# EAGLE schematic FullBoard (EAGLE 9.3.2)
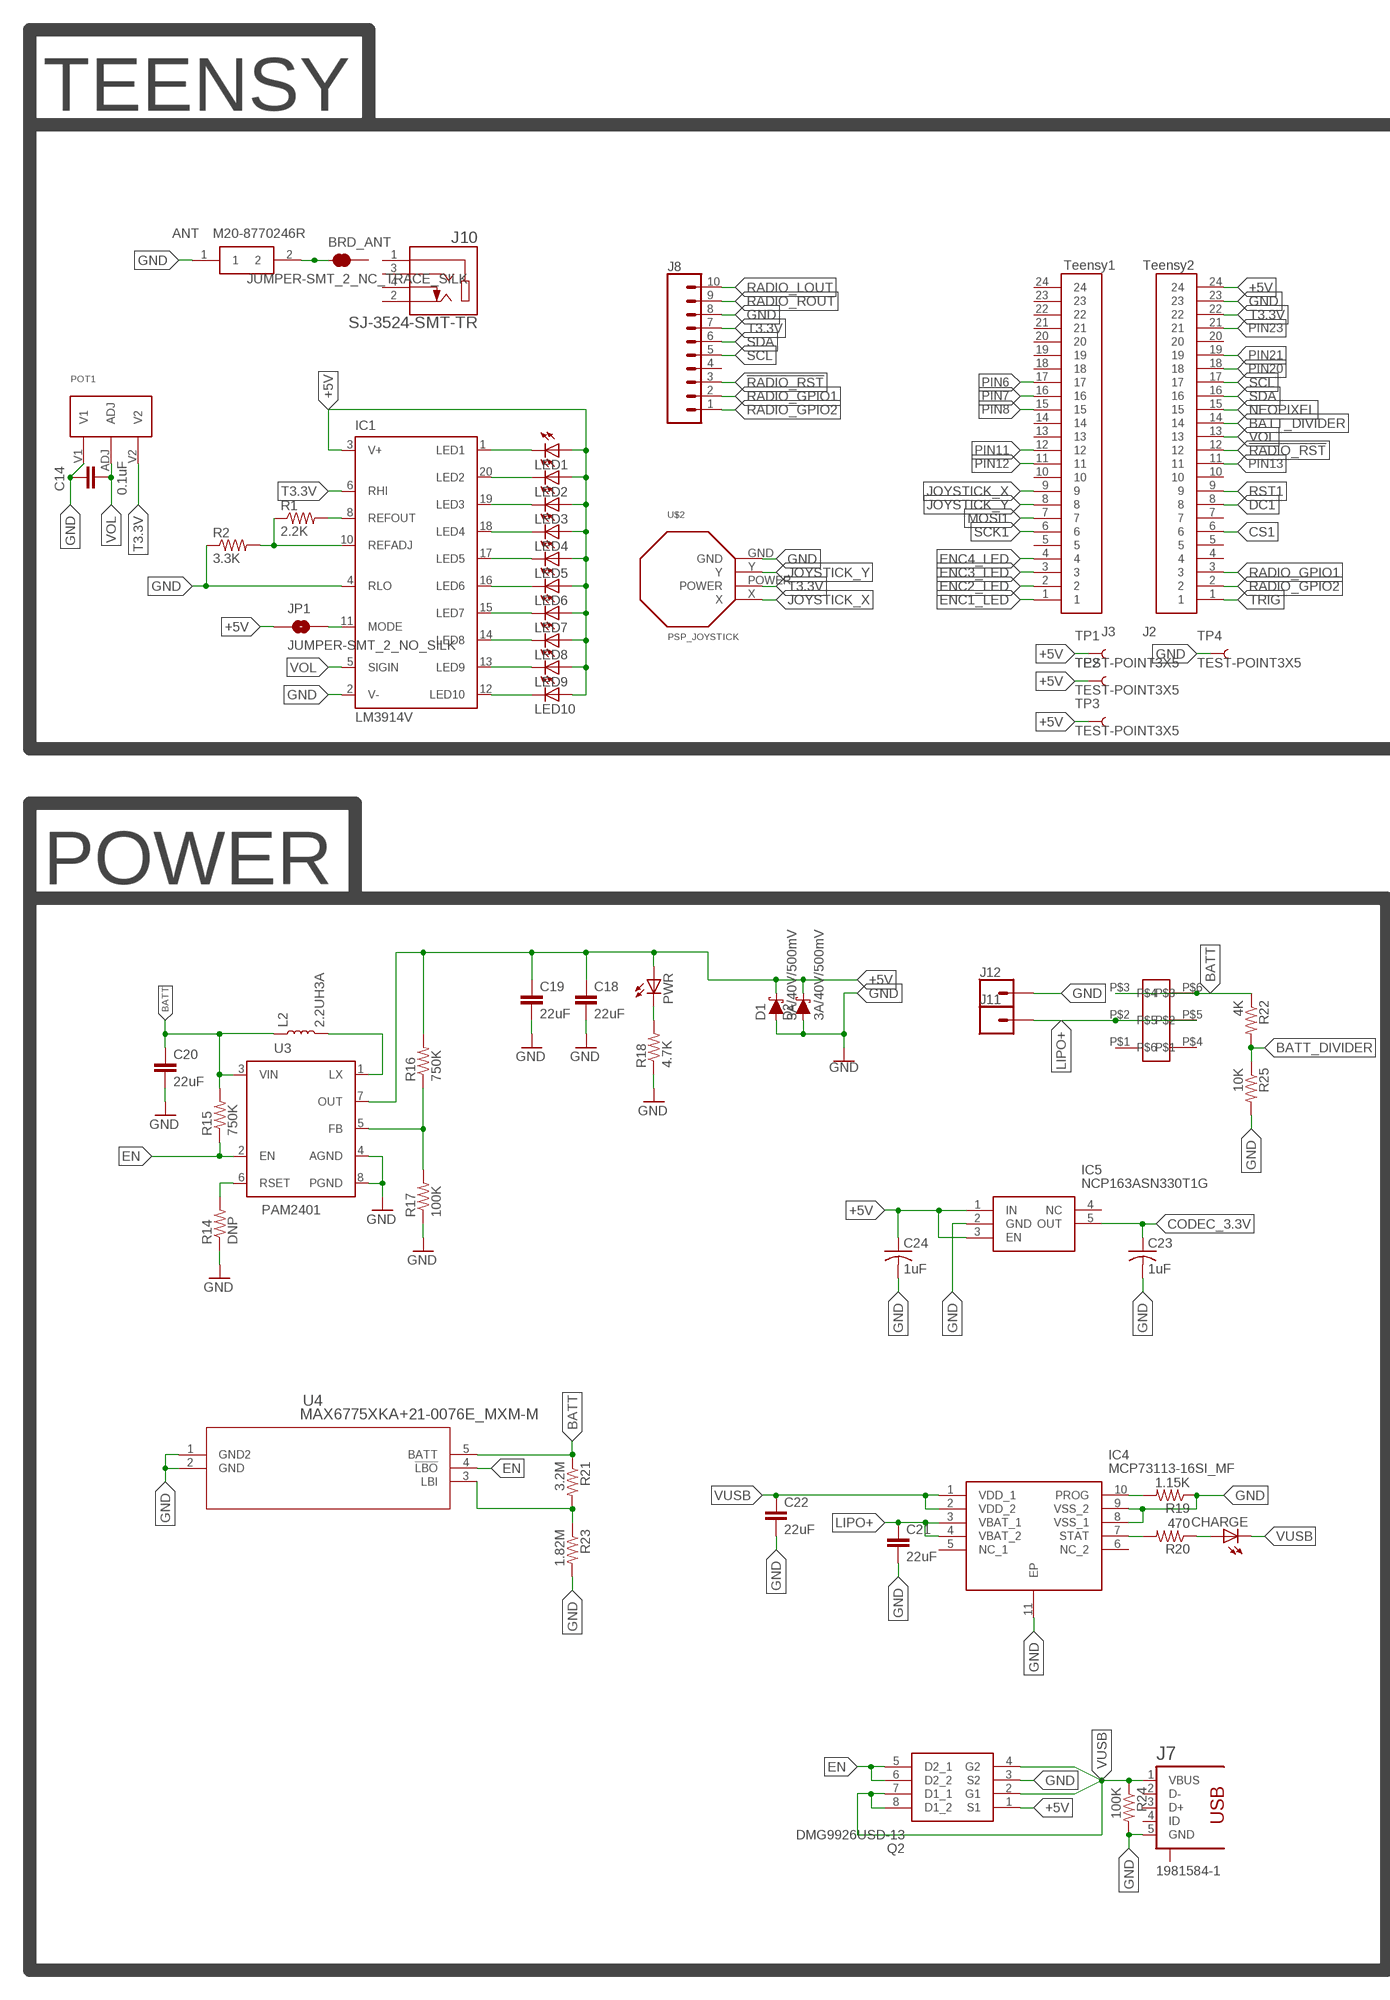
[diagram p0: schematic, sheet 1, part 1 of 3]
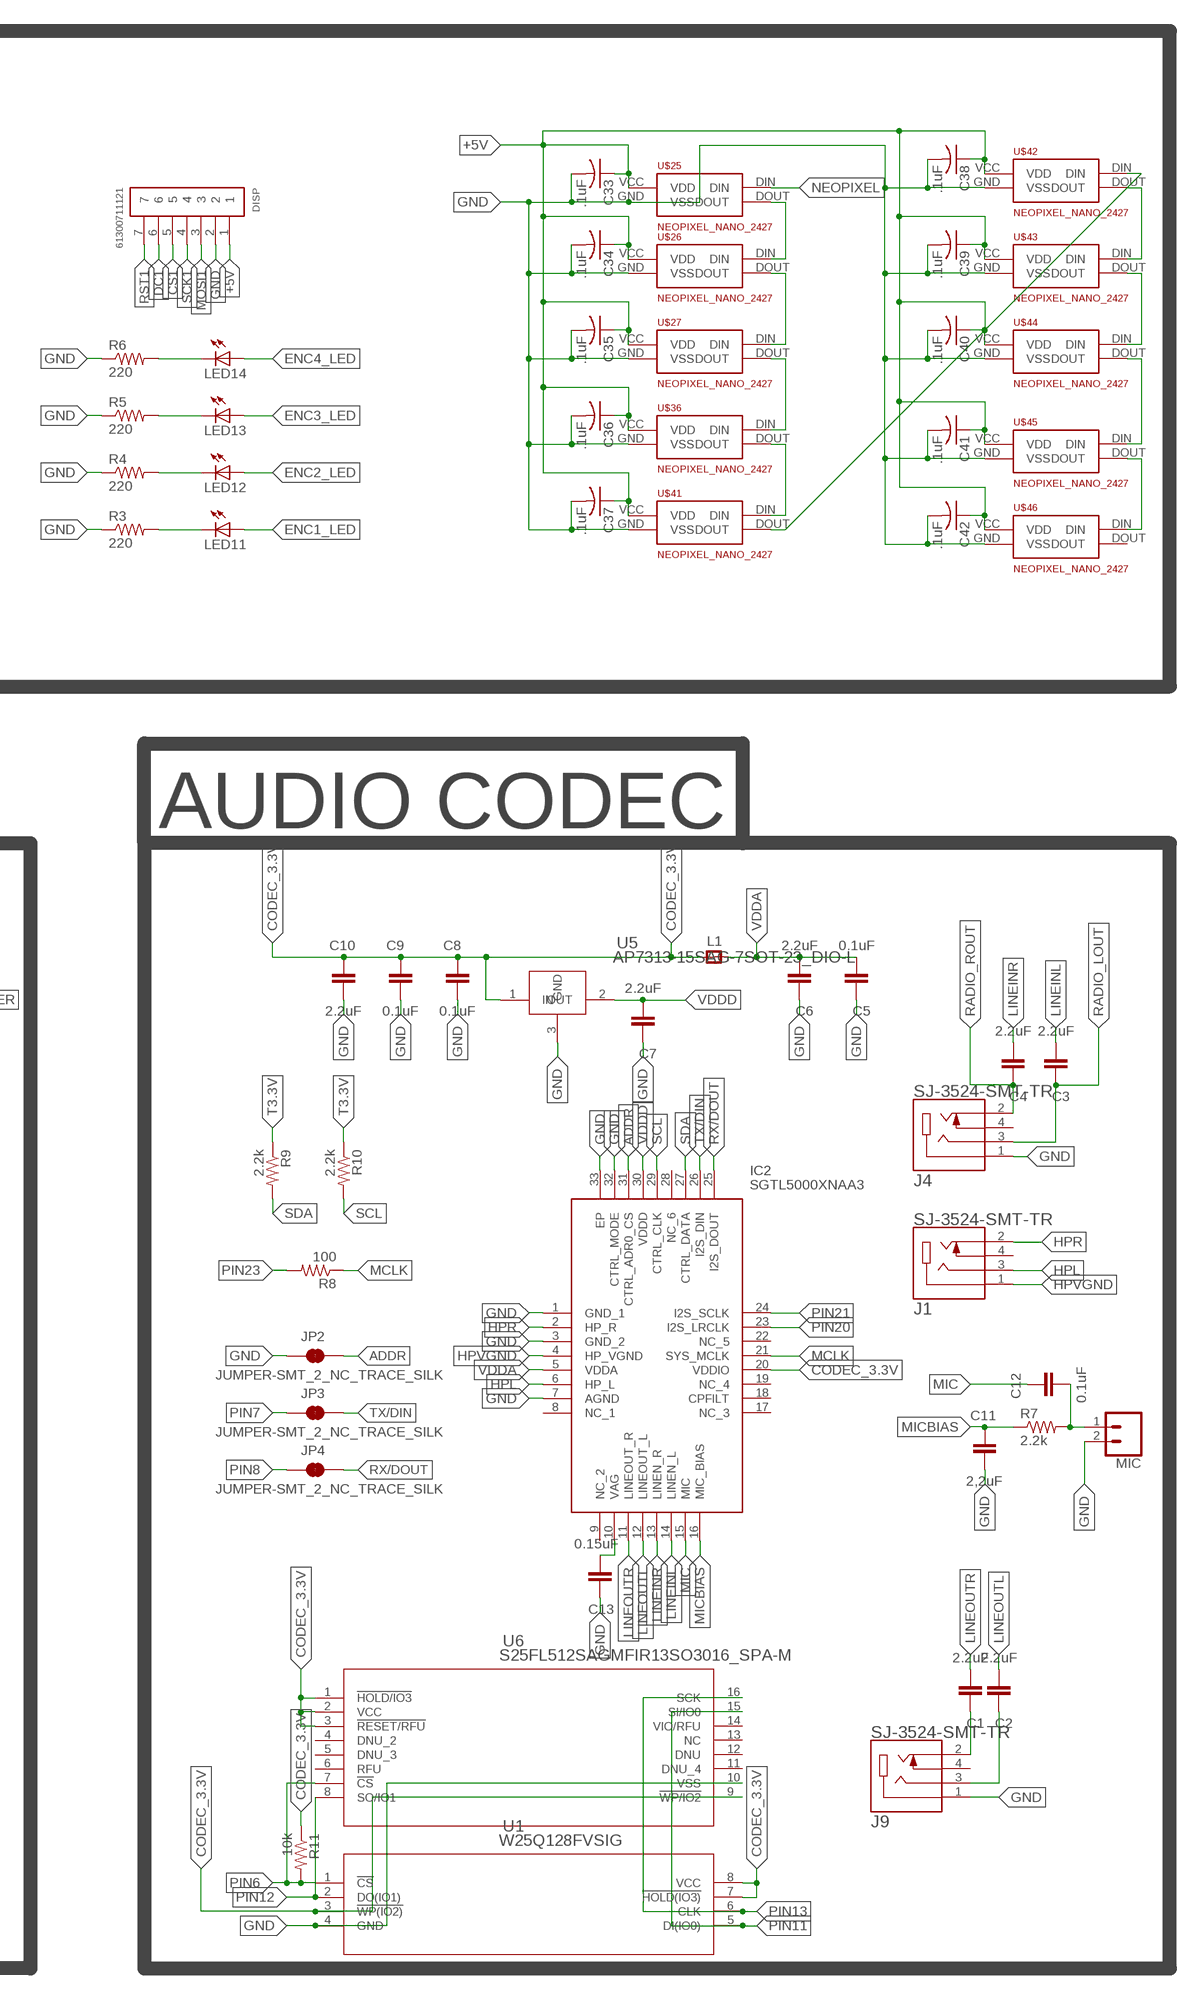
[diagram p1: schematic, sheet 1, part 2 of 3]
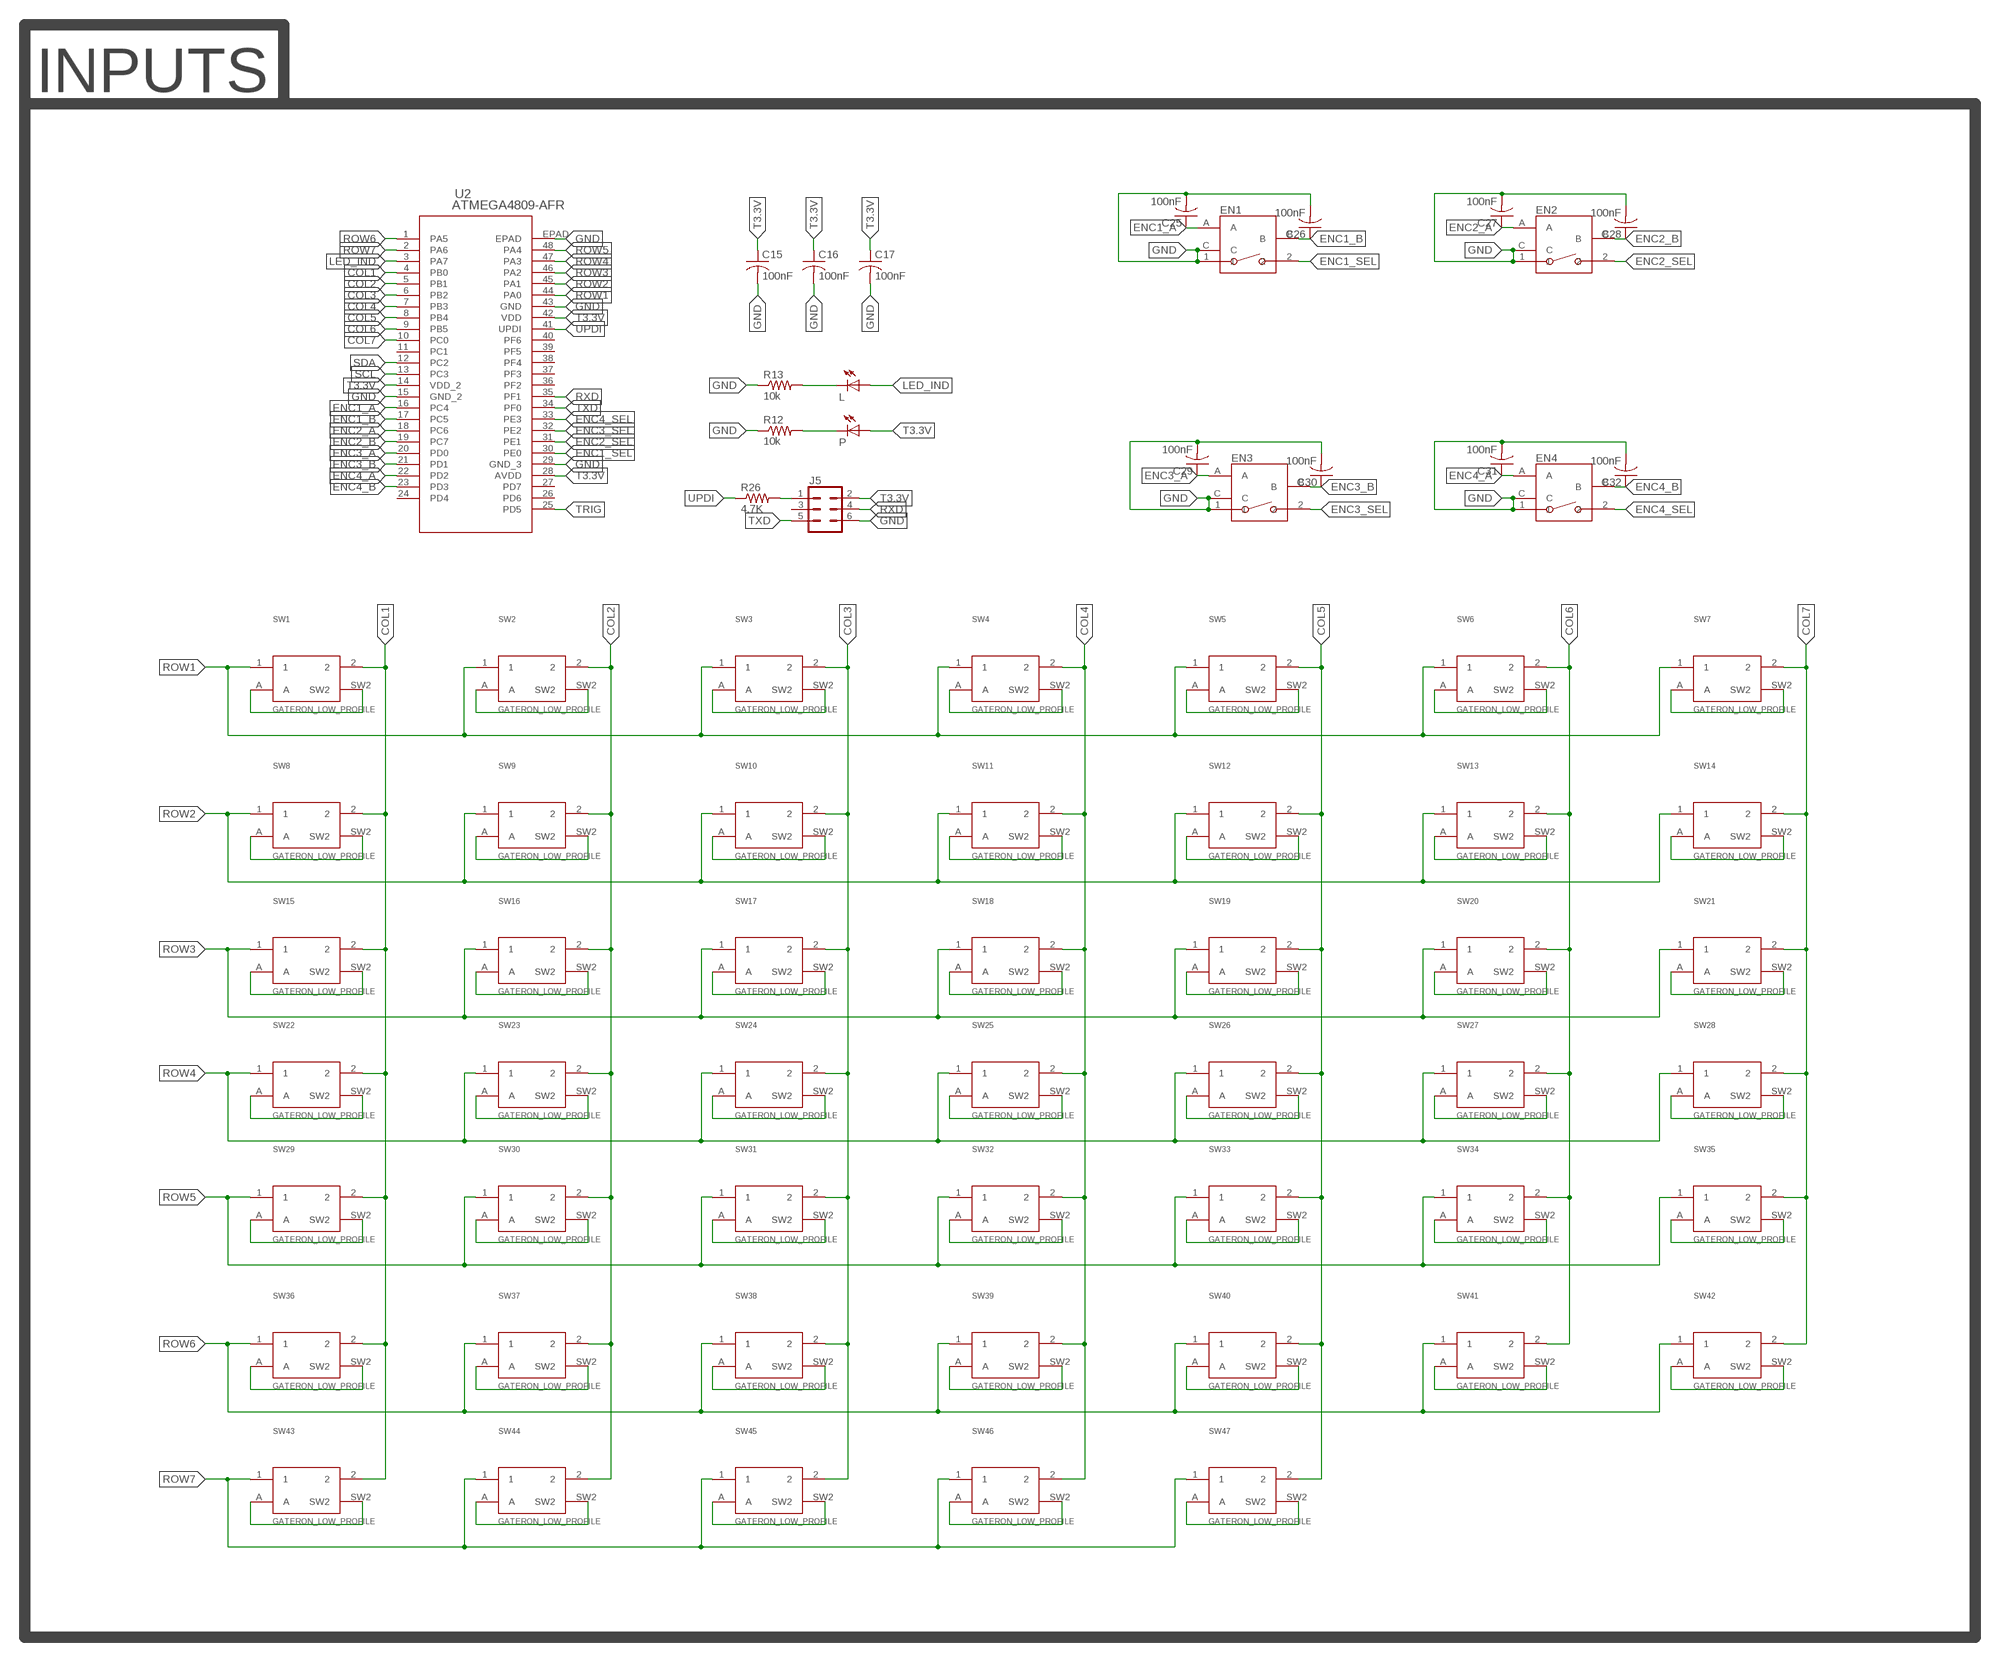
[diagram p2: schematic, sheet 1, part 3 of 3]

## Parts
ANT  M20-8770246R  [M208770246R]
BRD_ANT  JUMPER-SMT_2_NC_TRACE_SILK  [SMT-JUMPER_2_NC_TRACE_SILK]
C1  2.2uF  CC0805KRX7R9BB104  [CAP_0805]
C2  2.2uF  CC0805KRX7R9BB104  [CAP_0805]
C3  2.2uF  CC0805KRX7R9BB104  [CAP_0805]
C4  2.2uF  CC0805KRX7R9BB104  [CAP_0805]
C5  0.1uF  CC0805KRX7R9BB104  [CAP_0805]
C6  2.2uF  CC0805KRX7R9BB104  [CAP_0805]
C7  2.2uF  CC0805KRX7R9BB104  [CAP_0805]
C8  0.1uF  CC0805KRX7R9BB104  [CAP_0805]
C9  0.1uF  CC0805KRX7R9BB104  [CAP_0805]
C10  2.2uF  CC0805KRX7R9BB104  [CAP_0805]
C11  2,2uF  CC0805KRX7R9BB104  [CAP_0805]
C12  0.1uF  CC0805KRX7R9BB104  [CAP_0805]
C13  0.15uF  CC0805KRX7R9BB104  [CAP_0805]
C14  0.1uF  CC0805KRX7R9BB104  [CAP_0805]
C15  100nF  C-USC0805  [C0805]
C16  100nF  C-USC0805  [C0805]
C17  100nF  C-USC0805  [C0805]
C18  22uF  22UF-0805-6.3V-20%  [0805]
C19  22uF  22UF-0805-6.3V-20%  [0805]
C20  22uF  22UF-0805-6.3V-20%  [0805]
C21  22uF  22UF-0805-6.3V-20%  [0805]
C22  22uF  22UF-0805-6.3V-20%  [0805]
C23  1uF  C-USC1206  [C1206]
C24  1uF  C-USC1206  [C1206]
C25  100nF  C-USC0805  [C0805]
C26  100nF  C-USC0805  [C0805]
C27  100nF  C-USC0805  [C0805]
C28  100nF  C-USC0805  [C0805]
C29  100nF  C-USC0805  [C0805]
C30  100nF  C-USC0805  [C0805]
C31  100nF  C-USC0805  [C0805]
C32  100nF  C-USC0805  [C0805]
C33  .1uF  C-USC0805  [C0805]
C34  .1uF  C-USC0805  [C0805]
C35  .1uF  C-USC0805  [C0805]
C36  .1uF  C-USC0805  [C0805]
C37  .1uF  C-USC0805  [C0805]
C38  .1uF  C-USC0805  [C0805]
C39  .1uF  C-USC0805  [C0805]
C40  .1uF  C-USC0805  [C0805]
C41  .1uF  C-USC0805  [C0805]
C42  .1uF  C-USC0805  [C0805]
CHARGE  LEDCHIPLED_0805  [CHIPLED_0805]
D1  3A/40V/500mV  DIODE-SCHOTTKY-B340A  [SMA-DIODE]
D2  3A/40V/500mV  DIODE-SCHOTTKY-B340A  [SMA-DIODE]
DISP  61300711121  [61300711121]
EN1  PEC11R-4215K-S0024  [PEC11R-4215K-S0024]
EN2  PEC11R-4215K-S0024  [PEC11R-4215K-S0024]
EN3  PEC11R-4215K-S0024  [PEC11R-4215K-S0024]
EN4  PEC11R-4215K-S0024  [PEC11R-4215K-S0024]
IC1  LM3914V  [PLCC20S]
IC2  SGTL5000XNAA3  [QFN50P500X500X90-33N]
IC4  MCP73113-16SI_MF  [SON50P300X300X100-11N]
IC5  NCP163ASN330T1G  [SOT95P280X145-5N]
J1  SJ-3524-SMT-TR  [SJ-3524-SMT-TR]
J2  Teensy2  61302411121  [61302411121]
J3  Teensy1  61302411121  [61302411121]
J4  SJ-3524-SMT-TR  [SJ-3524-SMT-TR]
J5  CONN_03X2FEMALE_SMD  [2X3_SMD]
J7  1981584-1  [1981584-1]
J8  CONN_10SMD_MALE  [1X10_SMD_MALE]
J9  SJ-3524-SMT-TR  [SJ-3524-SMT-TR]
J10  SJ-3524-SMT-TR  [SJ-3524-SMT-TR]
J11  CONN_01  [1X01]
J12  CONN_01  [1X01]
JP1  JUMPER-SMT_2_NO_SILK  [SMT-JUMPER_2_NO_SILK]
JP2  JUMPER-SMT_2_NC_TRACE_SILK  [SMT-JUMPER_2_NC_TRACE_SILK]
JP3  JUMPER-SMT_2_NC_TRACE_SILK  [SMT-JUMPER_2_NC_TRACE_SILK]
JP4  JUMPER-SMT_2_NC_TRACE_SILK  [SMT-JUMPER_2_NC_TRACE_SILK]
L  LEDCHIPLED_0805  [CHIPLED_0805]
L1  RC-MASTER-SMD_FB_0805MP  [RC-MASTER-SMD_L0805MP]
L2  2.2UH3A  INDUCTOR-IFSC1515AHER2R2M01  [INDUCTOR_4X4MM]
LED1  LEDCHIP-LED0805  [CHIP-LED0805]
LED2  LEDCHIP-LED0805  [CHIP-LED0805]
LED3  LEDCHIP-LED0805  [CHIP-LED0805]
LED4  LEDCHIP-LED0805  [CHIP-LED0805]
LED5  LEDCHIP-LED0805  [CHIP-LED0805]
LED6  LEDCHIP-LED0805  [CHIP-LED0805]
LED7  LEDCHIP-LED0805  [CHIP-LED0805]
LED8  LEDCHIP-LED0805  [CHIP-LED0805]
LED9  LEDCHIP-LED0805  [CHIP-LED0805]
LED10  LEDCHIP-LED0805  [CHIP-LED0805]
LED11  LEDCHIPLED_0805  [CHIPLED_0805]
LED12  LEDCHIPLED_0805  [CHIPLED_0805]
LED13  LEDCHIPLED_0805  [CHIPLED_0805]
LED14  LEDCHIPLED_0805  [CHIPLED_0805]
MIC  CONN_02  [1X02]
P  LEDCHIPLED_0805  [CHIPLED_0805]
POT1  P0915N_POT  [PO915N_POT]
PWR  LEDCHIPLED_0805  [CHIPLED_0805]
Q2  DMG9926USD-13  [SOIC127P600X175-8N]
R1  2.2K  R-US_M0805  [M0805]
R2  3.3K  R-US_M0805  [M0805]
R3  220  R-US_R0805  [R0805]
R4  220  R-US_R0805  [R0805]
R5  220  R-US_R0805  [R0805]
R6  220  R-US_R0805  [R0805]
R7  2.2k  R-US_R0805  [R0805]
R8  100  R-US_R0805  [R0805]
R9  2.2k  R-US_R0805  [R0805]
R10  2.2k  R-US_R0805  [R0805]
R11  10k  R-US_R0805  [R0805]
R12  10k  R-US_R0805  [R0805]
R13  10k  R-US_R0805  [R0805]
R14  DNP  R-US_M0805  [M0805]
R15  750K  R-US_M0805  [M0805]
R16  750K  R-US_M0805  [M0805]
R17  100K  R-US_M0805  [M0805]
R18  4.7K  R-US_M0805  [M0805]
R19  1.15K  R-US_M0805  [M0805]
R20  470  R-US_M0805  [M0805]
R21  3.2M  R-US_M0805  [M0805]
R22  4K  R-US_M0805  [M0805]
R23  1.82M  R-US_M0805  [M0805]
R24  100K  R-US_M0805  [M0805]
R25  10K  R-US_M0805  [M0805]
R26  4.7K  R-US_R0805  [R0805]
SW1  GATERON_LOW_PROFILE  [GATERON_LP_PLAIN]
SW2  GATERON_LOW_PROFILE  [GATERON_LP_PLAIN]
SW3  GATERON_LOW_PROFILE  [GATERON_LP_PLAIN]
SW4  GATERON_LOW_PROFILE  [GATERON_LP_PLAIN]
SW5  GATERON_LOW_PROFILE  [GATERON_LP_PLAIN]
SW6  GATERON_LOW_PROFILE  [GATERON_LP_PLAIN]
SW7  GATERON_LOW_PROFILE  [GATERON_LP_PLAIN]
SW8  GATERON_LOW_PROFILE  [GATERON_LP_PLAIN]
SW9  GATERON_LOW_PROFILE  [GATERON_LP_PLAIN]
SW10  GATERON_LOW_PROFILE  [GATERON_LP_PLAIN]
SW11  GATERON_LOW_PROFILE  [GATERON_LP_PLAIN]
SW12  GATERON_LOW_PROFILE  [GATERON_LP_PLAIN]
SW13  GATERON_LOW_PROFILE  [GATERON_LP_PLAIN]
SW14  GATERON_LOW_PROFILE  [GATERON_LP_PLAIN]
SW15  GATERON_LOW_PROFILE  [GATERON_LP_PLAIN]
SW16  GATERON_LOW_PROFILE  [GATERON_LP_PLAIN]
SW17  GATERON_LOW_PROFILE  [GATERON_LP_PLAIN]
SW18  GATERON_LOW_PROFILE  [GATERON_LP_PLAIN]
SW19  GATERON_LOW_PROFILE  [GATERON_LP_PLAIN]
SW20  GATERON_LOW_PROFILE  [GATERON_LP_PLAIN]
SW21  GATERON_LOW_PROFILE  [GATERON_LP_PLAIN]
SW22  GATERON_LOW_PROFILE  [GATERON_LP_PLAIN]
SW23  GATERON_LOW_PROFILE  [GATERON_LP_PLAIN]
SW24  GATERON_LOW_PROFILE  [GATERON_LP_PLAIN]
SW25  GATERON_LOW_PROFILE  [GATERON_LP_PLAIN]
SW26  GATERON_LOW_PROFILE  [GATERON_LP_PLAIN]
SW27  GATERON_LOW_PROFILE  [GATERON_LP_PLAIN]
SW28  GATERON_LOW_PROFILE  [GATERON_LP_PLAIN]
SW29  GATERON_LOW_PROFILE  [GATERON_LP_PLAIN]
SW30  GATERON_LOW_PROFILE  [GATERON_LP_PLAIN]
SW31  GATERON_LOW_PROFILE  [GATERON_LP_PLAIN]
SW32  GATERON_LOW_PROFILE  [GATERON_LP_PLAIN]
SW33  GATERON_LOW_PROFILE  [GATERON_LP_PLAIN]
SW34  GATERON_LOW_PROFILE  [GATERON_LP_PLAIN]
SW35  GATERON_LOW_PROFILE  [GATERON_LP_PLAIN]
SW36  GATERON_LOW_PROFILE  [GATERON_LP_PLAIN]
SW37  GATERON_LOW_PROFILE  [GATERON_LP_PLAIN]
SW38  GATERON_LOW_PROFILE  [GATERON_LP_PLAIN]
SW39  GATERON_LOW_PROFILE  [GATERON_LP_PLAIN]
SW40  GATERON_LOW_PROFILE  [GATERON_LP_PLAIN]
SW41  GATERON_LOW_PROFILE  [GATERON_LP_PLAIN]
SW42  GATERON_LOW_PROFILE  [GATERON_LP_PLAIN]
SW43  GATERON_LOW_PROFILE  [GATERON_LP_PLAIN]
SW44  GATERON_LOW_PROFILE  [GATERON_LP_PLAIN]
SW45  GATERON_LOW_PROFILE  [GATERON_LP_PLAIN]
SW46  GATERON_LOW_PROFILE  [GATERON_LP_PLAIN]
SW47  GATERON_LOW_PROFILE  [GATERON_LP_PLAIN]
TP1  TEST-POINT3X5  [PAD.03X.05]
TP2  TEST-POINT3X5  [PAD.03X.05]
TP3  TEST-POINT3X5  [PAD.03X.05]
TP4  TEST-POINT3X5  [PAD.03X.05]
U1  W25Q128FVSIG  [WIN_S-8_WIN]
U2  ATMEGA4809-AFR  [TQFP48_7X7MC_MCH]
U3  PAM2401  [MSOP8]
U4  MAX6775XKA+21-0076E_MXM-M  [21-0076E_MXM-M]
U5  AP7313-15SAG-7SOT-23_DIO-L  [SOT-23_DIO-L]
U6  S25FL512SAGMFIR13SO3016_SPA-M  [SO3016_SPA-M]
U$1  JS202011JAQN  [JS202011JAQN]
U$2  PSP_JOYSTICK  [PSP_JOYSTICK]
U$25  NEOPIXEL_NANO_2427  [SK6805-2427]
U$26  NEOPIXEL_NANO_2427  [SK6805-2427]
U$27  NEOPIXEL_NANO_2427  [SK6805-2427]
U$36  NEOPIXEL_NANO_2427  [SK6805-2427]
U$41  NEOPIXEL_NANO_2427  [SK6805-2427]
U$42  NEOPIXEL_NANO_2427  [SK6805-2427]
U$43  NEOPIXEL_NANO_2427  [SK6805-2427]
U$44  NEOPIXEL_NANO_2427  [SK6805-2427]
U$45  NEOPIXEL_NANO_2427  [SK6805-2427]
U$46  NEOPIXEL_NANO_2427  [SK6805-2427]

## Nets
!RADIO_RST: J2.12 J8.3
+5V: C18.1 C19.1 C24.1 C33.1 C34.1 C35.1 C36.1 C37.1 C38.1 C39.1 C40.1 C41.1 C42.1 D1.C D2.C DISP.1 IC1.3(V+) IC5.1(IN) IC5.3(EN) J2.24 JP1.1 LED1.A LED2.A LED3.A LED4.A LED5.A LED6.A LED7.A LED8.A LED9.A LED10.A PWR.A Q2.1(S1) R16.2 TP1.P$1 TP2.P$1 TP3.P$1 U3.7(OUT) U$25.VCC(VDD) U$26.VCC(VDD) U$27.VCC(VDD) U$36.VCC(VDD) U$41.VCC(VDD) U$42.VCC(VDD) U$43.VCC(VDD) U$44.VCC(VDD) U$45.VCC(VDD) U$46.VCC(VDD)
ADDR: IC2.31(CTRL_ADR0_CS) JP2.2
BATT: C20.1 L2.P$1 R15.2 R21.1 R22.1 U3.3(VIN) U4.5(BATT) U$1.P$3 U$1.P$6
BATT_DIVIDER: J2.14 R22.2 R25.1
CODEC_3.3V: C8.1 C9.1 C10.1 C23.1 IC2.20(VDDIO) IC5.5(OUT) L1.1 R11.1 U1.3(!WP(IO2)) U1.7(!HOLD(IO3)) U1.8(VCC) U5.1(IN) U6.1(!HOLD/IO3) U6.2(VCC) U6.3(!RESET/RFU) U6.9(!WP/IO2)
COL1: SW1.2 SW8.2 SW15.2 SW22.2 SW29.2 SW36.2 SW43.2 U2.4(PB0)
COL2: SW2.2 SW9.2 SW16.2 SW23.2 SW30.2 SW37.2 SW44.2 U2.5(PB1)
COL3: SW3.2 SW10.2 SW17.2 SW24.2 SW31.2 SW38.2 SW45.2 U2.6(PB2)
COL4: SW4.2 SW11.2 SW18.2 SW25.2 SW32.2 SW39.2 SW46.2 U2.7(PB3)
COL5: SW5.2 SW12.2 SW19.2 SW26.2 SW33.2 SW40.2 SW47.2 U2.8(PB4)
COL6: SW6.2 SW13.2 SW20.2 SW27.2 SW34.2 SW41.2 U2.9(PB5)
COL7: SW7.2 SW14.2 SW21.2 SW28.2 SW35.2 SW42.2 U2.10(PC0)
CS1: DISP.5 J2.6
DC1: DISP.6 J2.8
EN: Q2.5(D2_1) Q2.6(D2_2) R15.1 U3.2(EN) U4.4(!LBO)
ENC1_A: C25.1 EN1.A U2.16(PC4)
ENC1_B: C26.1 EN1.B U2.17(PC5)
ENC1_LED: J3.1 LED11.A
ENC1_SEL: EN1.2 U2.30(PE0)
ENC2_A: C27.1 EN2.A U2.18(PC6)
ENC2_B: C28.1 EN2.B U2.19(PC7)
ENC2_LED: J3.2 LED12.A
ENC2_SEL: EN2.2 U2.31(PE1)
ENC3_A: C29.1 EN3.A U2.20(PD0)
ENC3_B: C30.1 EN3.B U2.21(PD1)
ENC3_LED: J3.3 LED13.A
ENC3_SEL: EN3.2 U2.32(PE2)
ENC4_A: C31.1 EN4.A U2.22(PD2)
ENC4_B: C32.1 EN4.B U2.23(PD3)
ENC4_LED: J3.4 LED14.A
ENC4_SEL: EN4.2 U2.33(PE3)
GND: ANT.1 C5.1 C6.1 C7.1 C8.2 C9.2 C10.2 C11.2 C13.1 C14.1 C15.2 C16.2 C17.2 C18.2 C19.2 C20.2 C21.2 C22.2 C23.2 C24.2 C25.2 C26.2 C27.2 C28.2 C29.2 C30.2 C31.2 C32.2 C33.2 C34.2 C35.2 C36.2 C37.2 C38.2 C39.2 C40.2 C41.2 C42.2 D1.A D2.A DISP.2 EN1.1 EN1.C EN2.1 EN2.C EN3.1 EN3.C EN4.1 EN4.C IC1.2(V-) IC1.4(RLO) IC2.1(GND_1) IC2.3(GND_2) IC2.7(AGND) IC2.32(CTRL_MODE) IC2.33(EP) IC4.8(VSS_1) IC4.9(VSS_2) IC4.11(EP) IC5.2(GND) J2.23 J4.1 J5.6 J7.5(GND) J8.8 J9.1 J12.1 JP2.1 MIC.2 POT1.V1 Q2.3(S2) R2.1 R3.1 R4.1 R5.1 R6.1 R12.1 R13.1 R14.1 R17.1 R18.1 R19.1 R23.2 R24.2 R25.2 TP4.P$1 U1.4(GND) U2.15(GND_2) U2.29(GND_3) U2.43(GND) U2.EPAD U3.4(AGND) U3.8(PGND) U4.1(GND2) U4.2(GND) U5.3(GND) U6.10(VSS) U$2.GND U$25.GND(VSS) U$26.GND(VSS) U$27.GND(VSS) U$36.GND(VSS) U$41.GND(VSS) U$42.GND(VSS) U$43.GND(VSS) U$44.GND(VSS) U$45.GND(VSS) U$46.GND(VSS)
HPL: IC2.6(HP_L) J1.3
HPR: IC2.2(HP_R) J1.2
HPVGND: IC2.4(HP_VGND) J1.1
JOYSTICK_X: J3.9 U$2.X
JOYSTICK_Y: J3.8 U$2.Y
LED_IND: L.A U2.3(PA7)
LINEINL: C3.2 IC2.14(LINEN_L)
LINEINR: C4.2 IC2.13(LINEN_R)
LINEOUTL: C2.2 IC2.12(LINEOUT_L)
LINEOUTR: C1.2 IC2.11(LINEOUT_R)
LIPO+: C21.1 IC4.3(VBAT_1) IC4.4(VBAT_2) J11.1 U$1.P$2 U$1.P$5
MCLK: IC2.21(SYS_MCLK) R8.1
MIC: C12.1 IC2.15(MIC)
MICBIAS: C11.1 IC2.16(MIC_BIAS) R7.1
MOSI1: DISP.3 J3.7
N$1: IC1.18(LED4) LED4.C
N$2: IC1.1(LED1) LED1.C
N$3: IC1.20(LED2) LED2.C
N$4: IC1.19(LED3) LED3.C
N$5: SW1.A SW1.SW2
N$6: IC1.17(LED5) LED5.C
N$7: IC1.16(LED6) LED6.C
N$8: IC1.15(LED7) LED7.C
N$9: IC1.14(LED8) LED8.C
N$10: IC1.13(LED9) LED9.C
N$11: IC1.12(LED10) LED10.C
N$12: IC1.10(REFADJ) R1.1 R2.2
N$13: IC1.11(MODE) JP1.2
N$14: IC1.8(REFOUT) R1.2
N$15: LED12.C R4.2
N$16: LED14.C R6.2
N$17: LED13.C R5.2
N$18: C13.2 IC2.10(VAG)
N$19: C12.2 MIC.1 R7.2
N$20: C1.1 J9.2
N$21: C2.1 J9.3
N$24: SW2.A SW2.SW2
N$25: SW3.A SW3.SW2
N$26: SW4.A SW4.SW2
N$27: SW5.A SW5.SW2
N$28: SW6.A SW6.SW2
N$29: SW7.A SW7.SW2
N$30: SW8.A SW8.SW2
N$31: SW9.A SW9.SW2
N$32: SW10.A SW10.SW2
N$33: SW11.A SW11.SW2
N$34: SW12.A SW12.SW2
N$35: SW13.A SW13.SW2
N$36: SW14.A SW14.SW2
N$37: SW15.A SW15.SW2
N$38: SW16.A SW16.SW2
N$39: SW17.A SW17.SW2
N$40: SW18.A SW18.SW2
N$41: SW19.A SW19.SW2
N$42: SW20.A SW20.SW2
N$43: SW21.A SW21.SW2
N$44: SW22.A SW22.SW2
N$45: SW23.A SW23.SW2
N$46: SW24.A SW24.SW2
N$47: SW25.A SW25.SW2
N$48: SW26.A SW26.SW2
N$49: SW27.A SW27.SW2
N$50: SW28.A SW28.SW2
N$51: SW29.A SW29.SW2
N$52: SW30.A SW30.SW2
N$53: SW31.A SW31.SW2
N$54: SW32.A SW32.SW2
N$55: SW33.A SW33.SW2
N$56: SW34.A SW34.SW2
N$57: SW35.A SW35.SW2
N$58: SW36.A SW36.SW2
N$59: SW37.A SW37.SW2
N$60: SW38.A SW38.SW2
N$61: SW39.A SW39.SW2
N$62: SW40.A SW40.SW2
N$63: SW41.A SW41.SW2
N$64: SW42.A SW42.SW2
N$65: SW43.A SW43.SW2
N$66: SW44.A SW44.SW2
N$67: SW45.A SW45.SW2
N$68: SW46.A SW46.SW2
N$69: SW47.A SW47.SW2
N$70: L.C R13.2
N$71: P.C R12.2
N$72: LED11.C R3.2
N$73: R16.1 R17.2 U3.5(FB)
N$74: L2.P$2 U3.1(LX)
N$75: R14.2 U3.6(RSET)
N$76: PWR.C R18.2
N$77: IC4.10(PROG) R19.2
N$78: IC4.7(STAT) R20.2
N$79: CHARGE.A R20.1
N$80: R21.2 R23.1 U4.3(LBI)
N$81: U$25.DOUT U$26.DIN
N$82: U$26.DOUT U$27.DIN
N$83: U$27.DOUT U$36.DIN
N$84: U$36.DOUT U$41.DIN
N$85: U$41.DOUT U$42.DIN
N$86: U$42.DOUT U$43.DIN
N$87: U$43.DOUT U$44.DIN
N$88: U$44.DOUT U$45.DIN
N$89: U$45.DOUT U$46.DIN
N$90: ANT.2 BRD_ANT.1
N$92: J5.1 R26.2
NEOPIXEL: J2.15 U$25.DIN
PIN6: J3.17 R11.2 U1.1(!CS) U6.7(!CS)
PIN7: J3.16 JP3.1
PIN8: J3.15 JP4.1
PIN11: J3.12 U1.5(DI(IO0)) U6.15(SI/IO0)
PIN12: J3.11 U1.2(DO(IO1)) U6.8(SO/IO1)
PIN13: J2.11 U1.6(CLK) U6.16(SCK)
PIN20: IC2.23(I2S_LRCLK) J2.18
PIN21: IC2.24(I2S_SCLK) J2.19
PIN23: J2.21 R8.2
RADIO_GPIO1: J2.3 J8.2
RADIO_GPIO2: J2.2 J8.1
RADIO_LOUT: C3.1 J4.3 J8.10
RADIO_ROUT: C4.1 J4.2 J8.9
ROW1: SW1.1 SW2.1 SW3.1 SW4.1 SW5.1 SW6.1 SW7.1 U2.44(PA0)
ROW2: SW8.1 SW9.1 SW10.1 SW11.1 SW12.1 SW13.1 SW14.1 U2.45(PA1)
ROW3: SW15.1 SW16.1 SW17.1 SW18.1 SW19.1 SW20.1 SW21.1 U2.46(PA2)
ROW4: SW22.1 SW23.1 SW24.1 SW25.1 SW26.1 SW27.1 SW28.1 U2.47(PA3)
ROW5: SW29.1 SW30.1 SW31.1 SW32.1 SW33.1 SW34.1 SW35.1 U2.48(PA4)
ROW6: SW36.1 SW37.1 SW38.1 SW39.1 SW40.1 SW41.1 SW42.1 U2.1(PA5)
ROW7: SW43.1 SW44.1 SW45.1 SW46.1 SW47.1 U2.2(PA6)
RST1: DISP.7 J2.9
RX/DOUT: IC2.25(I2S_DOUT) JP4.2
RXD: J5.4 U2.35(PF1)
SCK1: DISP.4 J3.6
SCL: IC2.29(CTRL_CLK) J2.17 J8.5 R10.2 U2.13(PC3)
SDA: IC2.27(CTRL_DATA) J2.16 J8.6 R9.2 U2.12(PC2)
T3.3V: C15.1 C16.1 C17.1 IC1.6(RHI) J2.22 J5.2 J8.7 P.A POT1.V2 R9.1 R10.1 U2.14(VDD_2) U2.28(AVDD) U2.42(VDD) U$2.POWER
TRIG: J2.1 U2.25(PD5)
TX/DIN: IC2.26(I2S_DIN) JP3.2
TXD: J5.5 U2.34(PF0)
UPDI: R26.1 U2.41(UPDI)
VDDA: C5.2 C6.2 IC2.5(VDDA) L1.2
VDDD: C7.2 IC2.30(VDDD) U5.2(OUT)
VOL: C14.2 IC1.5(SIGIN) J2.13 POT1.ADJ
VUSB: C22.1 CHARGE.C IC4.1(VDD_1) IC4.2(VDD_2) J7.1(VBUS) Q2.2(G1) Q2.4(G2) Q2.7(D1_1) Q2.8(D1_2) R24.1
Unconnected: BRD_ANT.2 IC2.8(NC_1) IC2.9(NC_2) IC2.17(NC_3) IC2.18(CPFILT) IC2.19(NC_4) IC2.22(NC_5) IC2.28(NC_6) IC4.5(NC_1) IC4.6(NC_2) IC5.4(NC) J1.4 J2.4 J2.5 J2.7 J2.10 J2.20 J3.5 J3.10 J3.13 J3.14 J3.18 J3.19 J3.20 J3.21 J3.22 J3.23 J3.24 J4.4 J5.3 J7.2(D-) J7.3(D+) J7.4(ID) J7.S1 J8.4 J9.4 J10.1 J10.2 J10.3 J10.4 U2.11(PC1) U2.24(PD4) U2.26(PD6) U2.27(PD7) U2.36(PF2) U2.37(PF3) U2.38(PF4) U2.39(PF5) U2.40(PF6) U6.4(DNU_2) U6.5(DNU_3) U6.6(RFU) U6.11(DNU_4) U6.12(DNU) U6.13(NC) U6.14(VIO/RFU) U$1.P$1 U$1.P$4 U$46.DOUT

## Notes on the sheet
- TEENSY | INPUTS
- POWER | AUDIO CODEC

## Library data of the parts
ANT = SamacSys_Parts:M20-8770246R: 2.54mm (0.1") Pitch SIL SMT Pin Header, tin, 2 contacts, pick & place (Tape & Reel packing) Source: Datasheet <https://cdn.harwin.com/pdfs/M20-877R.pdf>; DESCRIPTION: 2.54mm (0.1") Pitch SIL SMT Pin Header, tin, 2 contacts, pick & place (Tape & Reel packing); HEIGHT: 10.01mm; MANUFACTURER_NAME: Harwin; MANUFACTURER_PART_NUMBER: M20-8770246R; MOUSER_PART_NUMBER: 855-M20-8770246R; MOUSER_PRICE-STOCK: https://www.mouser.co.uk/ProductDetail/Harwin/M20-8770246R?qs=EAjXr3gw%252B1bRvyls1Opmew%3D%3D
BRD_ANT JP2-JP4 = SparkFun-Jumpers:JUMPER-SMT_2_NC_TRACE: Normally closed trace jumper This jumper has a trace between two pads so it's normally closed (NC). Use a razor knife to open the connection. For best results follow the IPC guidelines for cutting traces: Cutout at least 0.063 mm (0.005 in). Remove all loose material to clean up the cut area. Seal the cut with an approved epoxy. Reapply solder to reclose the connection.
C1-C14 = Resistor_Capacitor:CC0805KRX7R9BB104: CAP CER 0.1UF 50V X7R 0805 Manufacturer's datasheet <http://www.yageo.com/documents/recent/UPY-GPHC_X7R_6.3V-to-50V_18.pdf>; CREATED_BY: PCBLayout.com; DIGIKEY_PART_NUMBER: 311-1140-2-ND; MANUFACTURER: Yageo; MPN: CC0805KRX7R9BB104; PACKAGE: SMD 0805
C15-C17 C23-C42 = adafruit:C-US: CAPACITOR, American symbol
C18-C22 = SparkFun-Capacitors:22UF: 22µF ceramic capacitors A capacitor is a passive two-terminal electrical component used to store electrical energy temporarily in an electric field.; PROD_ID: CAP-08402
CHARGE L LED1-LED14 P PWR = adafruit:LED: LED OSRAM: - CHIPLED LG R971, LG N971, LY N971, LG Q971, LY Q971, LO R971, LY R971 LH N974, LH R974 LS Q976, LO Q976, LY Q976 LO Q996 - Hyper CHIPLED LW Q18S LB Q993, LB Q99A, LB R99A - SideLED LS A670, LO A670, LY A670, LG A670, LP A670 LB A673, LV A673, LT A673, LW A673 LH A674 LY A675 LS A676, LA A676, LO A676, LY A676, LW A676 LS A679, LY A679, LG A679 - Hyper Micro SIDELED® LS Y876, LA Y876, LO Y876, LY Y876 LT Y87S - SmartLED LW L88C, LW L88S LB L89C, LB L89S, LG L890 LS L89K, LO L89K, LY L89K LS L896, LA L896, LO L896, LY L896 - TOPLED LS T670, LO T670, LY T670, LG T670, LP T670 LSG T670, LSP T670, LSY T670, LOP T670, LYG T670 LG T671, LOG T671, LSG T671 LB T673, LV T673, LT T673, LW T673 LH T674 LS T676, LA T676, LO T676, LY T676, LB T676, LH T676, LSB T676, LW T676 LB T67C, LV T67C, LT T67C, LS T67K, LO T67K, LY T67K, LW E67C LS E67B, LA E67B, LO E67B, LY E67B, LB E67C, LV E67C, LT E67C LW T67C LS T679, LY T679, LG T679 LS T770, LO T770, LY T770, LG T770, LP T770 LB T773, LV T773, LT T773, LW T773 LH T774 LS E675, LA E675, LY E675, LS T675 LS T776, LA T776, LO T776, LY T776, LB T776 LHGB T686 LT T68C, LB T68C - Hyper Mini TOPLED® LB M676 - Mini TOPLED Santana® LG M470 LS M47K, LO M47K, LY M47K Source: http://www.osram.convergy.de/
D1 D2 = SparkFun-DiscreteSemi:DIODE-SCHOTTKY: Schottky diode A Schottky diode is a semiconductor diode which has a low forward voltage drop and a very fast switching action.; PROD_ID: DIO-09886
DISP = Headers:61300711121: CONN HEADER VERT 7POS 2.54MM Manufacturer's datasheet <https://katalog.we-online.de/em/datasheet/6130xx11121.pdf>; CREATED_BY: PCBLayout.com; DIGI_KEY_PART_NUMBER: 732-5320-ND; MANUFACTURER: Wurth Electronics Inc.; MPN: 61300711121
EN1-EN4 = Encoders:PEC11R-4215K-S0024: ROTARY ENCODER MECHANICAL 24PPR Manufacturer's datasheet <https://www.bourns.com/docs/Product-Datasheets/PEC11R.pdf>; CREATED_BY: PCBLayout.com; DIGIKEY_PARTNO: PEC11R-4215K-S0024-ND; MANUFACTURER: Bourns Inc.; MPN: PEC11R-4215K-S0024; SPICEPREFIX: X
IC1 = national-semiconductor:LM391: Dot/Bar Display Driver Source: Data sheet LM3915 <http://www.national.com/ds/LM/LM3915.pdf> Data sheet LM3914 <http://www.national.com/ds/LM/LM3914.pdf>
IC2 = SamacSys_Parts:SGTL5000XNAA3: NXP, Audio Codec Stereo Audio 2-channel 24bit- 96kHz Serial-I2C, Serial-SPI 32-Pin QFN Source: Datasheet <http://www.nxp.com/docs/en/data-sheet/SGTL5000.pdf>; DESCRIPTION: NXP, Audio Codec Stereo Audio 2-channel 24bit- 96kHz Serial-I2C, Serial-SPI 32-Pin QFN; HEIGHT: 0.9mm; MANUFACTURER_NAME: NXP; MANUFACTURER_PART_NUMBER: SGTL5000XNAA3; MOUSER_PART_NUMBER: 841-SGTL5000XNAA3; MOUSER_PRICE-STOCK: https://www.mouser.co.uk/ProductDetail/NXP-Semiconductors/SGTL5000XNAA3?qs=g5o6z0NmdpQ52bnp6yi7dA%3D%3D
IC4 = SamacSys_Parts:MCP73113-16SI_MF: Single cell 6.5 OVP battery Charger Source: Datasheet <http://ww1.microchip.com/downloads/en/DeviceDoc/20002183E.pdf>; DESCRIPTION: Single cell 6.5 OVP battery Charger; HEIGHT: 1mm; MANUFACTURER_NAME: Microchip; MANUFACTURER_PART_NUMBER: MCP73113-16SI/MF; MOUSER_PART_NUMBER: 579-MCP73113-16SI/MF; MOUSER_PRICE-STOCK: https://www.mouser.co.uk/ProductDetail/Microchip-Technology/MCP73113-16SI-MF?qs=E6wAi2XWqcOPfjtQRKPDYw%3D%3D
IC5 = SamacSys_Parts:NCP163ASN330T1G: ON SEMICONDUCTOR - NCP163ASN330T1G - Fixed LDO Voltage Regulator, 2.2V to 5.5V, 105mV drop, 3.3V/250mA out, SOT-23-5 Source: Datasheet <https://componentsearchengine.com/Datasheets/2/NCP163ASN330T1G.pdf>; DESCRIPTION: ON SEMICONDUCTOR - NCP163ASN330T1G - Fixed LDO Voltage Regulator, 2.2V to 5.5V, 105mV drop, 3.3V/250mA out, SOT-23-5; HEIGHT: 1.45mm; MANUFACTURER_NAME: ON Semiconductor; MANUFACTURER_PART_NUMBER: NCP163ASN330T1G; MOUSER_PART_NUMBER: 863-NCP163ASN330T1G; MOUSER_PRICE-STOCK: https://www.mouser.co.uk/ProductDetail/ON-Semiconductor/NCP163ASN330T1G?qs=vLWxofP3U2ykJIQb1%252BPKcA%3D%3D
J1 J4 J9 J10 = Audio Connectors:SJ-3524-SMT-TR: CONN JACK STEREO 3.5MM SMD R/A Manufacturer's datasheet <https://www.cuidevices.com/product/resource/sj-352x-smt.pdf>; CREATED_BY: PCBLayout.com; DIGIKEY_PARTNO: CP-3524SJTR-ND; MANUFCATURER: CUI Devices; MPN: SJ-3524-SMT-TR
J2 J3 = Headers:61302411121: CONN HEADER VERT 24POS 2.54MM Manufacturer's datasheet <https://katalog.we-online.de/em/datasheet/6130xx11121.pdf>; CREATED_BY: PCBLayout.com; DIGIKEY_PART_NUMBER: 732-5331-ND; MANUFACTURER: Wurth Electronics Inc.; MPN: 61302411121
J5 = SparkFun-Connectors:CONN_03X2: Multi connection point. Often used as Generic Header-pin footprint for 0.1 inch spaced/style header connections You can populate with any combo of single row headers, but if you'd like an exact match, check these: Header - 2x3 (Male, 0.1") <https://www.sparkfun.com/products/12807> (PRT-12807) Header - 2x3 (Female, 0.1") <https://www.sparkfun.com/products/13010> (PRT-13010) 2x3 Pin Shrouded Header <https://www.sparkfun.com/products/10877> (PRT-10877) On any of the 0.1 inch spaced packages, you can populate with these: Break Away Headers - Straight <https://www.sparkfun.com/products/116> (PRT-00116) Break Away Male Headers - Right Angle <https://www.sparkfun.com/products/553> (PRT-00553) Female Headers <https://www.sparkfun.com/products/115> (PRT-00115) Break Away Headers - Machine Pin <https://www.sparkfun.com/products/117> (PRT-00117) Break Away Female Headers - Swiss Machine Pin <https://www.sparkfun.com/products/743> (PRT-00743) Special note: the shrouded connector mates well with our 3x2 ribbon cables: Ribbon Crimp Connector - 6-pin (2x3, Female) <https://www.sparkfun.com/products/10651> (PRT-10651) Ribbon Cable - 6 wire (15ft) <https://www.sparkfun.com/products/10646> (PRT-10646); PROD_ID: CONN-11290
J7 = audio amplifier example:1981584-1: Receptacle, micro-USB, type A/B Tyco Electronics
J8 = SparkFun-Connectors:CONN_10: Multi connection point. Often used as Generic Header-pin footprint for 0.1 inch spaced/style header connections On any of the 0.1 inch spaced packages, you can populate with these: Break Away Headers - Straight <https://www.sparkfun.com/products/116> (PRT-00116) Break Away Male Headers - Right Angle <https://www.sparkfun.com/products/553> (PRT-00553) Female Headers <https://www.sparkfun.com/products/115> (PRT-00115) Break Away Headers - Machine Pin <https://www.sparkfun.com/products/117> (PRT-00117) Break Away Female Headers - Swiss Machine Pin <https://www.sparkfun.com/products/743> (PRT-00743) Arduino Stackable Header - 10 Pin <https://www.sparkfun.com/products/11376> (PRT-11376) For SCREWTERMINALS and SPRING TERMINALS visit here: Screw Terimnals on SparkFun.com <https://www.sparkfun.com/search/results?term=Screw+Terminals> (5mm/3.5mm/2.54mm spacing) This device is also useful as a general connection point to wire up your design to another part of your project. Our various solder wires solder well into these plated through hole pads. Hook-Up Wire - Assortment (Stranded, 22 AWG) <https://www.sparkfun.com/products/11375> (PRT-11375) Hook-Up Wire - Assortment (Solid Core, 22 AWG) <https://www.sparkfun.com/products/11367> (PRT-11367) View the entire wire category on our website here <https://www.sparkfun.com/categories/141> Special notes: Molex polarized connector foot print use with SKU : PRT-08231 with associated crimp pins and housings. 1MM SMD Version SKU: PRT-10208 NOTES ON THE VARIANTS LOCK and LOCK_LONGPADS... This footprint was designed to help hold the alignment of a through-hole component (i.e. 6-pin header) while soldering it into place. You may notice that each hole has been shifted either up or down by 0.005 of an inch from it's more standard position (which is a perfectly straight line). This slight alteration caused the pins (the squares in the middle) to touch the edges of the holes. Because they are alternating, it causes a "brace" to hold the component in place. 0.005 has proven to be the perfect amount of "off-center" position when using our standard breakaway headers. Although looks a little odd when you look at the bare footprint, once you have a header in there, the alteration is very hard to notice. Also,if you push a header all the way into place, it is covered up entirely on the bottom side.; PROD_ID: CONN-11291
J11 J12 = SparkFun-Connectors:CONN_01: Single connection point. Often used as Generic Header-pin footprint for 0.1 inch spaced/style header connections On any of the 0.1 inch spaced packages, you can populate with these: Break Away Headers - Straight <https://www.sparkfun.com/products/116> (PRT-00116) Break Away Male Headers - Right Angle <https://www.sparkfun.com/products/553> (PRT-00553) Female Headers <https://www.sparkfun.com/products/115> (PRT-00115) Break Away Headers - Machine Pin <https://www.sparkfun.com/products/117> (PRT-00117) Break Away Female Headers - Swiss Machine Pin <https://www.sparkfun.com/products/743> (PRT-00743) This device is also useful as a general connection point to wire up your design to another part of your project. Our various solder wires solder well into these plated through hole pads. Hook-Up Wire - Assortment (Stranded, 22 AWG) <https://www.sparkfun.com/products/11375> (PRT-11375) Hook-Up Wire - Assortment (Solid Core, 22 AWG) <https://www.sparkfun.com/products/11367> (PRT-11367) View the entire wire category on our website here <https://www.sparkfun.com/categories/141> Special notes: SMTSO-256-ET is a "flush mount" nut for a 4-40 screw. We mostly use this on specialty testbeds; it is a nice way to connect hardware to your PCB at an adjustable hieght. Also note, the SNAP packages are for using a snappable style connector. We sell a baggie of snaps and they are also used on two LilyPad designs: Snap Assortment - 30 pack (male and female) <https://www.sparkfun.com/products/11347> (DEV-11347) LilyPad Arduino SimpleSnap <https://www.sparkfun.com/products/10941> (DEV-10941) LilyPad SimpleSnap Protoboard <https://www.sparkfun.com/products/10940> (DEV-10940)
JP1 = SparkFun-Jumpers:JUMPER-SMT_2_NO: Normally open jumper This jumper has two pads in close proximity to each other. Apply solder to close the connection. Round pads are easier to solder for beginners, but are a lot larger. SparkFun Product that uses the round pads: SparkFun EL Sequencer <https://www.sparkfun.com/products/12781>
L1 = 52101-101-REV-A:RC-MASTER-SMD_FB_: FERRITE BEAD
L2 = SparkFun-Coils:INDUCTOR: Inductors Resist changes in electrical current. Basically a coil of wire. SparkFun Products: SparkFun Load Cell Amplifier - HX711 <https://www.sparkfun.com/products/13879> IOIO-OTG - V2.2 <https://www.sparkfun.com/products/13613>; PROD_ID: NDUC-13770
MIC = SparkFun-Connectors:CONN_02: Multi connection point. Often used as Generic Header-pin footprint for 0.1 inch spaced/style header connections On any of the 0.1 inch spaced packages, you can populate with these: Break Away Headers - Straight <https://www.sparkfun.com/products/116> (PRT-00116) Break Away Male Headers - Right Angle <https://www.sparkfun.com/products/553> (PRT-00553) Female Headers <https://www.sparkfun.com/products/115> (PRT-00115) Break Away Headers - Machine Pin <https://www.sparkfun.com/products/117> (PRT-00117) Break Away Female Headers - Swiss Machine Pin <https://www.sparkfun.com/products/743> (PRT-00743) For SCREWTERMINALS and SPRING TERMINALS visit here: Screw Terimnals on SparkFun.com <https://www.sparkfun.com/search/results?term=Screw+Terminals> (5mm/3.5mm/2.54mm spacing) This device is also useful as a general connection point to wire up your design to another part of your project. Our various solder wires solder well into these plated through hole pads. Hook-Up Wire - Assortment (Stranded, 22 AWG) <https://www.sparkfun.com/products/11375> (PRT-11375) Hook-Up Wire - Assortment (Solid Core, 22 AWG) <https://www.sparkfun.com/products/11367> (PRT-11367) View the entire wire category on our website here <https://www.sparkfun.com/categories/141> Special notes: Molex polarized connector foot print use with: PRT-08233 with associated crimp pins and housings. 2.54_SCREWTERM for use with PRT-10571. 3.5mm Screw Terminal footprints for PRT-08084 5mm Screw Terminal footprints for use with PRT-08432
POT1 = P0915N Potentiometer:P0915N_POT
Q2 = SamacSys_Parts:DMG9926USD-13: Diodes Inc DMG9926USD-13 Dual N-channel MOSFET Transistor, 8 A, 20 V, 8-Pin SOP Source: Datasheet; DESCRIPTION: Diodes Inc DMG9926USD-13 Dual N-channel MOSFET Transistor, 8 A, 20 V, 8-Pin SOP; HEIGHT: 1.75mm; MANUFACTURER_NAME: Diodes Inc.; MANUFACTURER_PART_NUMBER: DMG9926USD-13; MOUSER_PART_NUMBER: 621-DMG9926USD-13; MOUSER_PRICE-STOCK: https://www.mouser.co.uk/ProductDetail/Diodes-Incorporated/DMG9926USD-13?qs=4YT44p7w2buzSaF0raP1iw%3D%3D
R1 R2 R14-R25 = adafruit:R-US_: RESISTOR, American symbol
R3-R6 R12 R13 R26 = audio amplifier example:R-US_: RESISTOR, American symbol
R7-R11 = BeagleBone_Black_Wireless:R-US_: RESISTOR, American symbol
SW1-SW47 = GateronLowProfile:GATERON_LOW_PROFILE
TP1-TP4 = SparkFun-Connectors:TEST-POINT: SparkFun Test Points Bare copper test points for troubleshooting or In-Circuit-Testing. These are used by our Production team for verifying production board runs using pogo-pins on test beds. SparkFun Products: SparkFun LSM9DS1 Breakout <https://www.sparkfun.com/products/13284> SparkFun PSOC <https://www.sparkfun.com/products/13714> SparkFun Load Cell Amplifier <https://www.sparkfun.com/products/13879>
U1 = SPIFlash:W25Q128FVSIG; BUILT_BY: EMA_UL_Team; COPYRIGHT: Copyright (C) 2018 Accelerated Designs. All rights reserved; MANUFACTURER_PART_NUMBER: W25Q128FVSIG; SOURCELIBRARY: Winbond_2018-12-15; VENDOR: Winbond
U2 = ATMEGA4809:ATMEGA4809-AFR; BUILT_BY: EMA_Jessica; COPYRIGHT: Copyright (C) 2018 Accelerated Designs. All rights reserved; MANUFACTURER_PART_NUMBER: ATMEGA4809-AFR; SOURCELIBRARY: Microchip_2019-12-30; VENDOR: Microchip
U3 = SparkFun-IC-Power:PAM2401: PAM2401 - Boost PMIC Specifications: Up to 1A output current 0.9V to 4.75V Input Range 2.5V to 5.0V Adjustable Output Voltage Datasheet <https://www.diodes.com/assets/Datasheets/PAM2401.pdf> (Diodes inc.); PROD_ID: IC-XXXXX
U4 = BatteryStuff:MAX6775XKA+; BUILT_BY: EMA_UL_Team; MANUFACTURER_PART_NUMBER: MAX6775XKA+; SOURCELIBRARY: Maxim_2014-05-21; VENDOR: Maxim Integrated Products
U5 = AP7313:AP7313-15SAG-7; BUILT_BY: EMA_UL_Team; MANUFACTURER_PART_NUMBER: AP7313-15SAG-7; SOURCELIBRARY: DIODESINC_2_2015-08-18; VENDOR: Diodes Inc
U6 = S25FL512SAGMFIR12SO3016:S25FL512SAGMFIR13; BUILT_BY: EMA_UL_Team; MANUFACTURER_PART_NUMBER: S25FL512SAGMFIR13; SOURCELIBRARY: Spansion_2012-01-01_S25_FL-S; VENDOR: Spansion
U$1 = SMD Slide Switch:JS202011JAQN
U$2 = PSP_Joystick:PSP_JOYSTICK
U$25-U$27 U$36 U$41-U$46 = NeoPixel Nano 2427:NEOPIXEL_NANO_2427